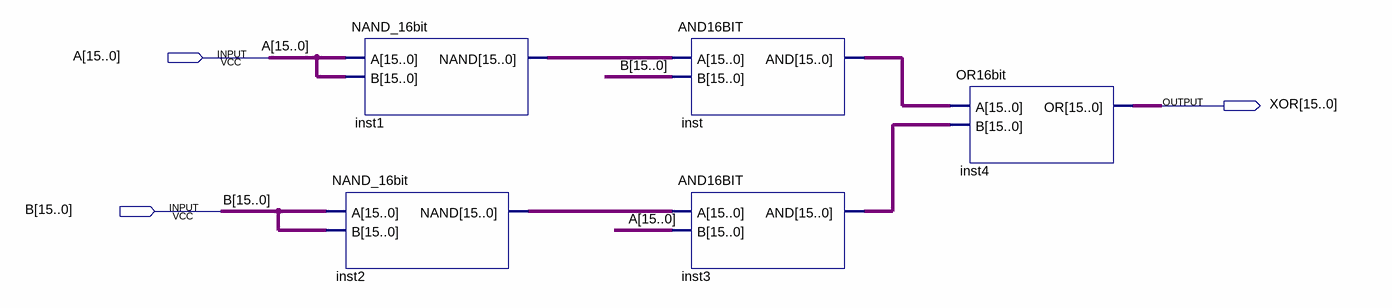
[diagram p0: schematic sheet]
// Quartus schematic XOR16bit.bdf as structural Verilog: 5 symbols, 3 pins
module XOR16bit (
  input  [15:0] A,
  input  [15:0] B,
  output [15:0] XOR
);

  wire [15:0] inst1_nand, inst2_nand, inst3_and, inst_and;

  NAND_16bit inst1 (.A(A), .B(A), .NAND(inst1_nand));
  NAND_16bit inst2 (.A(B), .B(B), .NAND(inst2_nand));
  AND16BIT inst (.A(inst1_nand), .B(B), .AND(inst_and));
  AND16BIT inst3 (.A(inst2_nand), .B(A), .AND(inst3_and));
  OR16bit inst4 (.A(inst_and), .B(inst3_and), .OR(XOR));
endmodule
